# Altium schematic sheet Mono_Bass_TPA3138D2.SchDoc
size A4; SheetNumber: 10; SheetTotal: 10
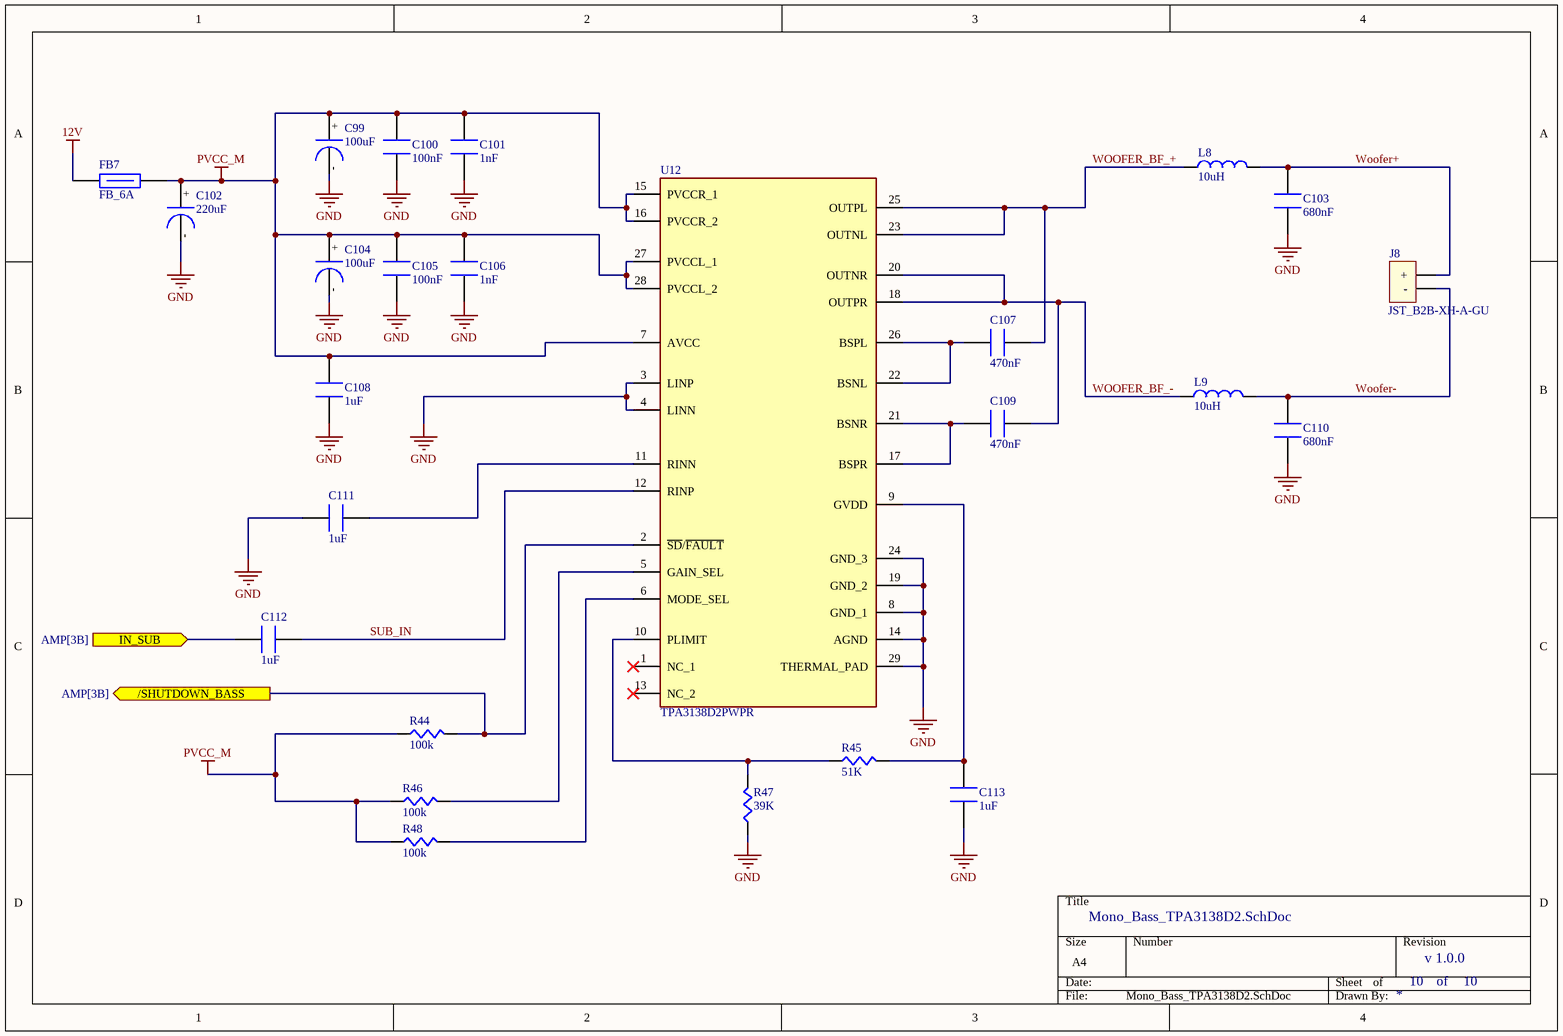
[diagram p0: Mono_Bass_TPA3138D2.SchDoc]

## Parts
C99  100uF  [CAPD6.3XL6.3X77M]
C100  100nF  [CAPC0603X8N]
C101  1nF  [CAPC0603X8N]
C102  220uF  [CAPD6.3XL6.3X77M]
C103  680nF  [CAPC1206X18N]
C104  100uF  [CAPD6.3XL6.3X77M]
C105  100nF  [CAPC0603X8N]
C106  1nF  [CAPC0603X8N]
C107  470nF  [CAPC1206X18N]
C108  1uF  [CAP0805X13N]
C109  470nF  [CAPC1206X18N]
C110  680nF  [CAPC1206X18N]
C111  1uF  [CAP0805X13N]
C112  1uF  [CAP0805X13N]
C113  1uF  [CAP0805X13N]
FB7  FB_6A  [FB0805X12N]
J8  JST_B2B-XH-A-GU  [JST_B2B_XH_A_GU]
L8  10uH  [INDC6060X45N]
L9  10uH  [INDC6060X45N]
R44  100k  [RECS0603X45N]
R45  51K  [RECS0603X45N]
R46  100k  [RECS0603X45N]
R47  39K  [RECS0603X45N]
R48  100k  [RECS0603X45N]
U12  TPA3138D2PWPR  [SOP65P640X120-29N]

## Ports
/SHUTDOWN_BASS (out, see AMP[3B]), IN_SUB (in, see AMP[3B])

## Nets
12V: FB7.1
GND: C99.2 C100.1 C101.1 C102.2 C103.1 C104.2 C105.1 C106.1 C108.1 C110.1 C111.1 C113.1 R47.1 U12.3(LINP) U12.4(LINN) U12.8(GND_1) U12.14(AGND) U12.19(GND_2) U12.24(GND_3) U12.29(THERMAL_PAD)
PVCC_M: C99.1 C100.2 C101.2 C102.1 C104.1 C105.2 C106.2 C108.2 FB7.2 R44.1 R46.1 R48.1 U12.7(AVCC) U12.15(PVCCR_1) U12.16(PVCCR_2) U12.27(PVCCL_1) U12.28(PVCCL_2)
/SHUTDOWN_BASS: R44.2 U12.2(~{SD}/~{FAULT}) ; port /SHUTDOWN_BASS
IN_SUB: C112.1 ; port IN_SUB
SUB_IN: C112.2 U12.12(RINP)
Woofer+: C103.2 J8.1(+) L8.2
Woofer-: C110.2 J8.2(-) L9.2
WOOFER_BF_+: C107.2 L8.1 U12.23(OUTNL) U12.25(OUTPL)
WOOFER_BF_-: C109.2 L9.1 U12.18(OUTPR) U12.20(OUTNR)
NetC107_1: C107.1 U12.22(BSNL) U12.26(BSPL)
NetC109_1: C109.1 U12.17(BSPR) U12.21(BSNR)
NetC111_2: C111.2 U12.11(RINN)
NetC113_2: C113.2 R45.2 U12.9(GVDD)
NetR45_1: R45.1 R47.2 U12.10(PLIMIT)
NetR46_2: R46.2 U12.5(GAIN_SEL)
NetR48_2: R48.2 U12.6(MODE_SEL)

Not connected (* = marked no-connect by the designer): U12 1(NC_1)* 13(NC_2)*

## Notes on the sheet
- v 1.0.0
- of
- (in symbol CPD6.3XL7.7_100uF_POLY) +; -
- (in symbol CPD6.3XL7.7_220uF_POLY) +; -

## Library data of the parts
C99 C104 = CPD6.3XL7.7_100uF_POLY: C5246554, HV1V107M0607PZ, -55℃~+105℃ 100uF 2.2mm 2000hrs 35V 6.3mm 7.7mm ±20% SMD,D6.3xL7.7mm Polymer Aluminum Capacitors ROHS; Supplier 1: LCSC; Supplier Part Number 1: C5246554
C100 C105 = CC0603_100nF_X7R: C14663, CC0603KRX7R9BB104, 100nF 50V X7R ±10% 0603 Multilayer Ceramic Capacitors MLCC - SMD/SMT ROHS; Supplier 1: element14 APAC; Supplier Part Number 1: CC0603KRX7R9BB104
C101 C106 = CC0603_1nF_X7R: C100040, CC0603KRX7R9BB102, 1nF 50V X7R ±10% 0603 Multilayer Ceramic Capacitors MLCC - SMD/SMT ROHS; Supplier 1: element14 APAC; Supplier Part Number 1: CC0603KRX7R9BB102
C102 = CPD6.3XL7.7_220uF_POLY: C5246541, HV1E227M0607PZ, -55℃~+105℃ 2.2mm 2000hrs 220uF 25V 6.3mm 7.7mm ±20% SMD,D6.3xL7.7mm Polymer Aluminum Capacitors ROHS; Supplier 1: LCSC; Supplier Part Number 1: C5246541
C103 C110 = CC1206_680nF_X7R: C145012, CC1206KKX7R9BB684, 50V 680nF X7R ±10% 1206 Multilayer Ceramic Capacitors MLCC - SMD/SMT ROHS; Supplier 1: element14 APAC; Supplier Part Number 1: CC1206KKX7R9BB684
C107 C109 = CC1206_470nF_X7R: C277483, CC1206KKX7R9BB474, 470nF 50V X7R ±10% 1206 Multilayer Ceramic Capacitors MLCC - SMD/SMT ROHS; Supplier 1: element14 APAC; Supplier Part Number 1: CC1206KKX7R9BB474
C108 C111-C113 = CC0805_1uF_X7R: C28323, CL21B105KBFNNNE, 1uF 50V X7R ±10% 0805 Multilayer Ceramic Capacitors MLCC - SMD/SMT ROHS; Supplier 1: Future Electronics; Supplier Part Number 1: CL21B105KBFNNNE
FB7 = FB0805_6A: C136227, MPZ2012S300AT000, -55℃~+125℃ 1 10mΩ 30Ω@100MHz 6A ±25% 0805 Ferrite Beads ROHS; Supplier 1: element14 APAC; Supplier Part Number 1: MPZ2012S300AT000
J8 = JST_B2B-XH-A-GU: C265283, B2B-XH-A-GU, -25℃~+85℃ 1 1x2P 2 2.5mm 250V 2P 3A 5.75mm 7.4mm 7mm Brass Gold K Pin PA66 Through Hole UL94V-0 White XH 插件,P=2.5mm Wire To Board Connector ROHS; Supplier 1: Verical; Supplier Part Number 1: B2B-XH-A-GU
L8 L9 = IN0606_10uH_2.7A: C168076, FNR6045S100MT, 10uH 2.7A 3.5A 62mΩ Magnetic Shielded Inductor ±20% SMD,6x6mm Power Inductors ROHS
R44 R46 R48 = RESC0603_100K_THIN: C116674, AC0603FR-07100KL, -55℃~+155℃ 100kΩ 100mW 75V Thick Film Resistor ±1% ±100ppm/℃ 0603 Chip Resistor - Surface Mount ROHS; Supplier 1: element14 APAC; Supplier Part Number 1: AC0603FR-07100KL
R45 = RESC0603_51K_THICK: C107231, RC0603FR-0751KL, -55℃~+155℃ 100mW 51kΩ 75V Thick Film Resistor ±1% ±100ppm/℃ 0603 Chip Resistor - Surface Mount ROHS; Supplier 1: element14 APAC; Supplier Part Number 1: RC0603FR-0751KL
R47 = RESC0603_39K_THICK: C163424, RC0603FR-0739KL, -55℃~+155℃ 100mW 39kΩ 75V Thick Film Resistor ±1% ±100ppm/℃ 0603 Chip Resistor - Surface Mount ROHS; Supplier 1: element14 APAC; Supplier Part Number 1: RC0603FR-0739KL
U12 = TPA3138D2PWPR: C475506, TPA3138D2PWPR, -10℃~+85℃ -70dB 0.04% 102dB 10W×2@6Ω、18.5W×1@4Ω 2-Channel 20mA 3.5V~14.4V Automatic mute/no-noise switch、Overvoltage protection、Digital programmable gain Class D TSSOP-28-EP Audio Amplifiers ROHS; Manufacturer_Name: Texas Instruments; Datasheet Link: http://www.ti.com/lit/gpn/tpa3138d2; Height: 1.2mm; Manufacturer_Part_Number: TPA3138D2PWPR; Mouser Part Number: 595-TPA3138D2PWPR; Mouser Price/Stock: https://www.mouser.co.uk/ProductDetail/Texas-Instruments/TPA3138D2PWPR?qs=fAHHVMwC%252BbipgX0F9%252BCw8A%3D%3D; Arrow Part Number: TPA3138D2PWPR; Arrow Price/Stock: null?region=nac; Supplier 1: DigiKey; Supplier Part Number 1: 296-51849-1-ND